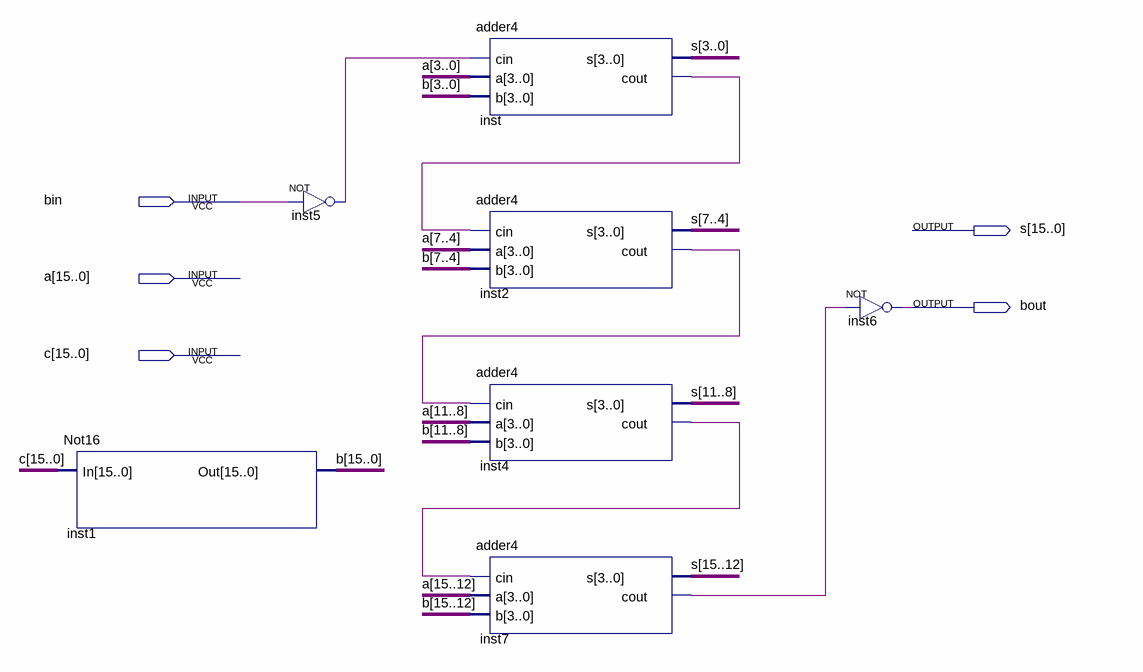
[diagram p0: schematic sheet]
// Quartus schematic subber16.bdf as structural Verilog: 7 symbols, 5 pins
module subber16 (
  input  bin,
  input  [15:0] a,
  input  [15:0] c,
  output [15:0] s,
  output bout
);

  wire inst2_cout, inst4_cout, inst5_out, inst7_cout, inst_cout;
  wire [15:0] b;

  Not16 inst1 (.In(c), .Out(b));
  not inst5 (inst5_out, bin);
  adder4 inst (.cin(inst5_out), .a(a[3:0]), .b(b[3:0]), .s(s[3:0]), .cout(inst_cout));
  adder4 inst2 (.cin(inst_cout), .a(a[7:4]), .b(b[7:4]), .s(s[7:4]), .cout(inst2_cout));
  adder4 inst4 (.cin(inst2_cout), .a(a[11:8]), .b(b[11:8]), .s(s[11:8]), .cout(inst4_cout));
  adder4 inst7 (.cin(inst4_cout), .a(a[15:12]), .b(b[15:12]), .s(s[15:12]), .cout(inst7_cout));
  not inst6 (bout, inst7_cout);
endmodule
